# EAGLE schematic protoA (EAGLE 9.3.0)
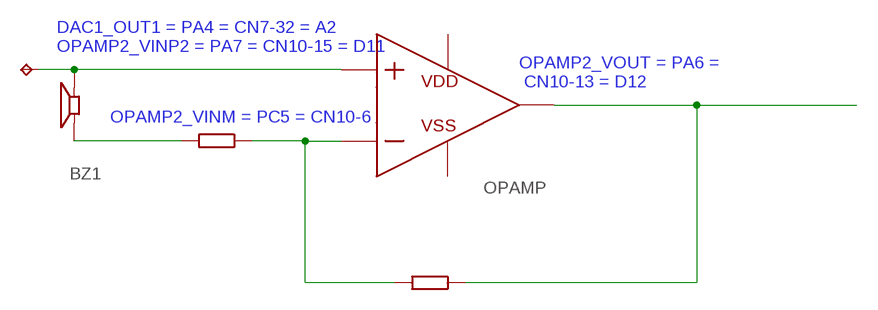
[diagram p0: schematic, sheet 1]

## Parts
BZ1  CEP-1116  [CEP-1116]
TP1  TPB1,27  [B1,27]
X1  OPAMP  (no package)

## Nets
N$1: X1.VOUT
N$2: X1.N
N$3: BZ1.2 TP1.TP X1.P
N$4: BZ1.1
Unconnected: X1.VDD X1.VSS

## Notes on the sheet
- DAC1_OUT1 = PA4 = CN7-32 = A2
  OPAMP2_VINP2 = PA7 = CN10-15 = D11
- OPAMP2_VOUT = PA6 =
   CN10-13 = D12
- OPAMP2_VINM = PC5 = CN10-6

## Library data of the parts
BZ1 = Microphone:CEP-1116: AUDIO PIEZO TRANSDUCER 30V TH Manufacturer's datasheet <https://www.cuidevices.com/product/resource/cep-1116.pdf>; CREATED_BY: PCBLayout.com; DIGIKEY_PARTNO: 102-1141-ND; MANUFACTURER: CUI Devices; MPN: CEP-1116
TP1 = testpad:TP: Test pad
X1 = ngspice-simulation:OPAMP: Operational amplifier with power pins